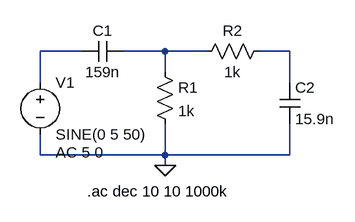
[diagram p0: schematic BandPass_RC.asc]
BandPass_RC.asc, the LTspice schematic file:
Version 4.1
SHEET 1 880 680
WIRE 96 64 32 64
WIRE 224 64 160 64
WIRE 288 64 224 64
WIRE 416 64 368 64
WIRE 224 96 224 64
WIRE 32 112 32 64
WIRE 416 112 416 64
WIRE 32 224 32 192
WIRE 224 224 224 176
WIRE 224 224 32 224
WIRE 416 224 416 176
WIRE 416 224 224 224
WIRE 224 240 224 224
FLAG 224 240 0
SYMBOL voltage 32 96 R0
WINDOW 123 24 124 Left 2
WINDOW 39 0 0 Left 0
SYMATTR InstName V1
SYMATTR Value SINE(0 5 50)
SYMATTR Value2 AC 5 0
SYMBOL cap 96 80 R270
WINDOW 0 32 32 VTop 2
WINDOW 3 0 32 VBottom 2
SYMATTR InstName C1
SYMATTR Value 159n
SYMBOL res 208 80 R0
SYMATTR InstName R1
SYMATTR Value 1k
SYMBOL res 272 80 R270
WINDOW 0 32 56 VTop 2
WINDOW 3 0 56 VBottom 2
SYMATTR InstName R2
SYMATTR Value 1k
SYMBOL cap 400 112 R0
SYMATTR InstName C2
SYMATTR Value 15.9n
TEXT 104 280 Left 2 !.ac dec 10 10 1000k

The netlist it stands for:
* BandPass_RC.asc
V1 N001 0 SINE(0 5 50) AC 5 0
C1 N001 N002 159n
R1 N002 0 1k
R2 N002 N003 1k
C2 N003 0 15.9n
.ac dec 10 10 1000k
.backanno
.end